# Altium schematic sheet Output_Switch.SchDoc
size A4
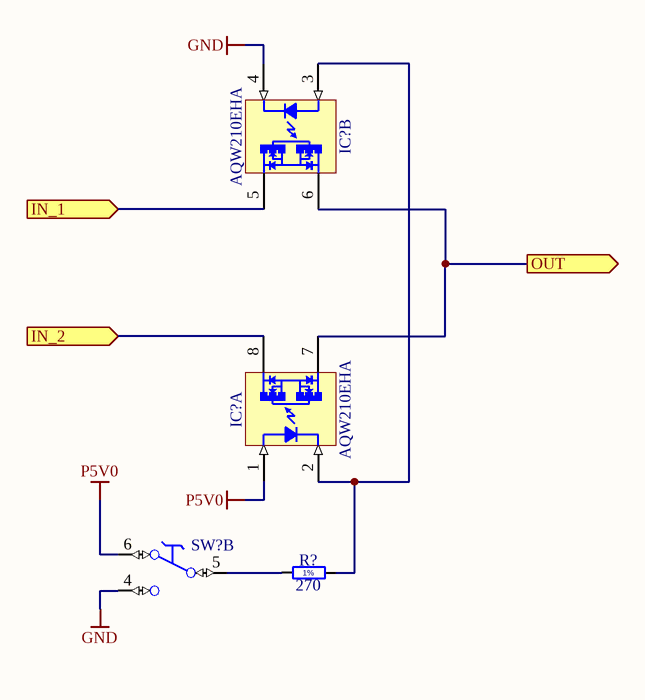
[diagram p0: Output_Switch.SchDoc]

## Parts
(Parts that share a designator on the sheet are numbered #1, #2 ... from top to bottom, then left to right.)
IC?#1  AQW210EHA  [PANASONIC_AQW21_EH(DIP)(SM8)]  (part B of 2)
IC?#2  AQW210EHA  [PANASONIC_AQW21_EH(DIP)(SM8)]  (part A of 2)
R?  270  [RESC1608X55N]
SW?  Switch  [SW_NIDEC-COPAL-ELECTRONICS_CAS-220TB]  (value not drawn)  (part B of 2)

## Ports
IN_1 (in), IN_2 (in), OUT (out)

## Nets
GND: IC?#1.4(K) SW?.4
P5V0: IC?#2.1(A) SW?.6
IN_1: IC?#1.5 ; port IN_1
IN_2: IC?#2.8(E) ; port IN_2
OUT: IC?#1.6 IC?#2.7(C) ; port OUT
NetIC?#1_3: IC?#1.3(A) IC?#2.2(K) R?.2
NetR?_1: R?.1 SW?.5

## Notes on the sheet
- (in symbol R0603_270R_1%_0.1W_100PPM) 1%

## Library data of the parts
IC?#1 IC?#2 = AQW210EHA: Dual PhotoMOS Relay; Part Description: GE 2 Form A, PhotoMOS Relay, 5000V Reinforced Insulation, 350V 120mA; Manufacturer: PANASONIC; PressFit: No; Bonding: No; Part Number: AQW210EHA; Component Kind: Standard; Component Type: Standard; Device: AQW210EHA; PackageDescription: PANASONIC AQW21 Gull Wing Surface Mount, 8-Leads, Body 9.86mm x 6.4mm, Pitch 2.54mm; Manufacturer Part Number: AQW210EHA; Pin Count: 8; Case: DIP8 SMD; Mounted: Yes; Socket: No; SMD: Yes; Sense: No; ComponentHeight: 3.15mm; HelpURL: \\cern.ch\dfs\Applications\Altium\Datasheets\AQW210EHA.pdf; ComponentLink1Description: Package Drawing; ComponentLink1URL: \\cern.ch\dfs\Applications\Altium\Datasheets\AQW210EHA_Package-Drawing.pdf; Author: CERN DEM JLC; CreateDate: 25.03.2009; LatestRevisionDate: 04.12.2018
R? = R0603_270R_1%_0.1W_100PPM: Resistor - 1%; Part Description: General Purpose Thick Film Chip Resistor; Manufacturer: GENERIC; Manufacturer1 Part Number: NRC06F2700TRF; Power: 0.1W; TC: ±100ppm/°C; PressFit: No; Part Number: R0603_270R_1%_0.1W_100PPM; Component Kind: Standard; Component Type: Standard; Pin Count: 2; Value: 270; Status: Preferred; Tolerance: ±1%; Manufacturer Part Number: R0603_270R_1%_0.1W_100PPM; Case: 0603; Mounted: Yes; Sense: No; Socket: No; SMD: Yes; Manufacturer1 Example: NIC COMPONENT; Manufacturer1 ComponentHeight: 0.55mm; HelpURL: \\cern.ch\dfs\Applications\Altium\Datasheets\R0603_NIC_NRC.pdf; Author: CERN DEM JLC; CreateDate: 03.12.2007; LatestRevisionDate: 13.03.2008
SW? = SW_NIDEC-COPAL-ELECTRONICS_CAS-220TB: DPDTSwitch; Part Description: DPDT Vertical Slide Switch, Surface Mount, Contact Rating 100mA 6VDC, CAS Series; Manufacturer: NIDEC COPAL ELECTRONICS; PressFit: No; Part Number: SW_NIDEC-COPAL-ELECTRONICS_CAS-220TB; Component Kind: Standard; Component Type: Standard; Pin Count: 6; PackageDescription: Body 5.4x3.9mm, DPDT Vertical Slide Switch, Surface Mount, CAS Series; Family: Switch; Mounted: Yes; Socket: No; SMD: Yes; Sense: No; Status: None; Manufacturer Part Number: CAS-220TB; ComponentHeight: 2.5mm; HelpURL: \\cern.ch\dfs\Applications\Altium\Datasheets\SW_NIDEC-COPAL-ELECTRONICS_CAS-220TB.pdf; Author: CERN DEM MR; CreateDate: 21.11.2019; LatestRevisionDate: 21.11.2019